# Altium schematic sheet P01 Note & Title.SchDoc
size 297 x 209 mm
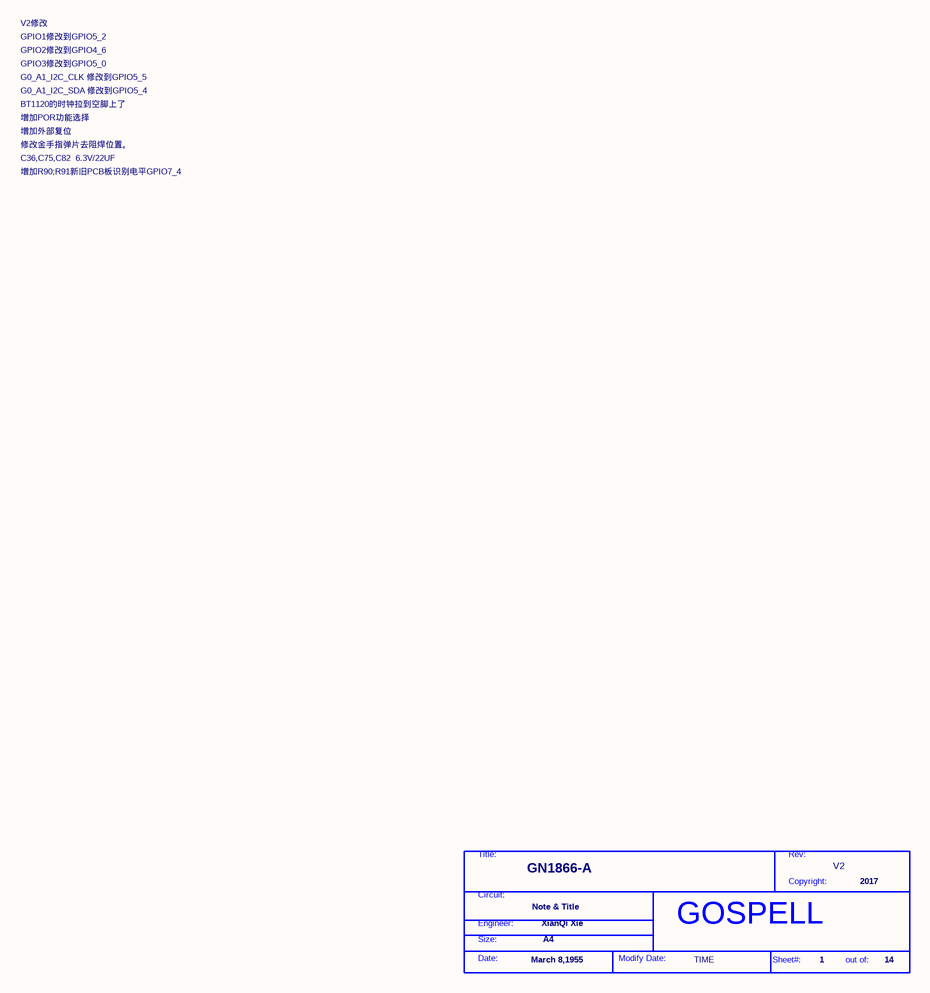
[diagram p0: P01 Note & Title.SchDoc]

## Parts
*  Page Modify Date: TIME  Engineer: XianQi Xie  Copyright: 2017  Title: GN1866-A  RevCode: V2  Page Size: A4  Page Create Date: March 8,1955  Page Number: 1  Page Count: 14  Doc: Note & Title  (hidden comment: GOSPELL)  (graphical)

## Notes on the sheet
- GPIO2修改到GPIO4_6
- V2修改
- GPIO1修改到GPIO5_2
- G0_A1_I2C_CLK 修改到GPIO5_5
- BT1120的时钟拉到空脚上了
- G0_A1_I2C_SDA 修改到GPIO5_4
- GPIO3修改到GPIO5_0
- 增加POR功能选择
- 增加外部复位
- 修改金手指弹片去阻焊位置。
- C36,C75,C82  6.3V/22UF
- 增加R90;R91新旧PCB板识别电平GPIO7_4
- (in symbol GOSPELL) Title:; Rev:; Copyright:; Circuit:; Engineer:; Size:; Date:; Modify Date:; Sheet#:; out of:

## Library data of the parts
* = GOSPELL: Cage Code: 2017